# Altium project usomiq-bone-cape.PrjPcb
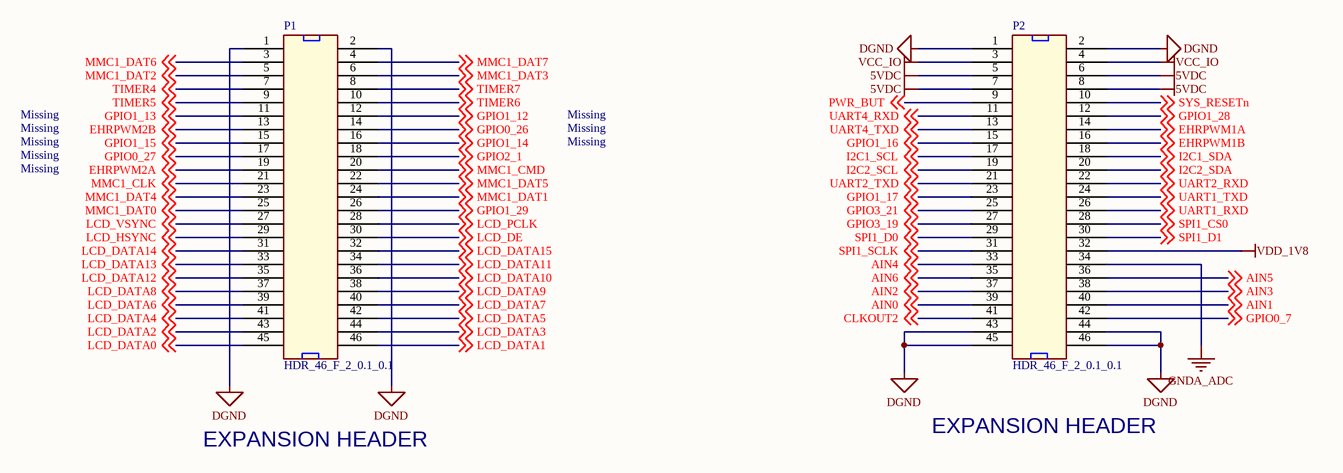
[diagram p0: bone_capes.SchDoc]
2 sheets, 61 parts. Net scope: global (net labels, ports and power ports of the same name join across sheets).
Board file: usomiq-bone-cape.PcbDoc
Sheets:
  bone_capes.SchDoc
  peripherals.SchDoc

## Sheet bone_capes.SchDoc
size A4

### Parts
P1  HDR_46_F_2_0.1_0.1  [DIP46]
P2  HDR_46_F_2_0.1_0.1  [DIP46]

### Nets
5VDC: P2.5 P2.6 P2.7 P2.8
DGND: P1.1 P1.2 P2.1 P2.2 P2.43 P2.44 P2.45 P2.46
GNDA_ADC: P2.34
VCC_IO: P2.3 P2.4
VDD_1V8: P2.32
AIN0: P2.39 ; off-sheet AIN0
AIN1: P2.40 ; off-sheet AIN1
AIN2: P2.37 ; off-sheet AIN2
AIN3: P2.38 ; off-sheet AIN3
AIN4: P2.33 ; off-sheet AIN4
AIN5: P2.36 ; off-sheet AIN5
AIN6: P2.35 ; off-sheet AIN6
CLKOUT2: P2.41 ; off-sheet CLKOUT2
EHRPWM1A: P2.14 ; off-sheet EHRPWM1A
EHRPWM1B: P2.16 ; off-sheet EHRPWM1B
EHRPWM2A: P1.19 ; off-sheet EHRPWM2A
EHRPWM2B: P1.13 ; off-sheet EHRPWM2B
GPIO0_7: P2.42 ; off-sheet GPIO0_7
GPIO0_26: P1.14 ; off-sheet GPIO0_26
GPIO0_27: P1.17 ; off-sheet GPIO0_27
GPIO1_12: P1.12 ; off-sheet GPIO1_12
GPIO1_13: P1.11 ; off-sheet GPIO1_13
GPIO1_14: P1.16 ; off-sheet GPIO1_14
GPIO1_15: P1.15 ; off-sheet GPIO1_15
GPIO1_16: P2.15 ; off-sheet GPIO1_16
GPIO1_17: P2.23 ; off-sheet GPIO1_17
GPIO1_28: P2.12 ; off-sheet GPIO1_28
GPIO1_29: P1.26 ; off-sheet GPIO1_29
GPIO2_1: P1.18 ; off-sheet GPIO2_1
GPIO3_19: P2.27 ; off-sheet GPIO3_19
GPIO3_21: P2.25 ; off-sheet GPIO3_21
I2C1_SCL: P2.17 ; off-sheet I2C1_SCL
I2C1_SDA: P2.18 ; off-sheet I2C1_SDA
I2C2_SCL: P2.19 ; off-sheet I2C2_SCL
I2C2_SDA: P2.20 ; off-sheet I2C2_SDA
LCD_DATA0: P1.45 ; off-sheet LCD_DATA0
LCD_DATA1: P1.46 ; off-sheet LCD_DATA1
LCD_DATA2: P1.43 ; off-sheet LCD_DATA2
LCD_DATA3: P1.44 ; off-sheet LCD_DATA3
LCD_DATA4: P1.41 ; off-sheet LCD_DATA4
LCD_DATA5: P1.42 ; off-sheet LCD_DATA5
LCD_DATA6: P1.39 ; off-sheet LCD_DATA6
LCD_DATA7: P1.40 ; off-sheet LCD_DATA7
LCD_DATA8: P1.37 ; off-sheet LCD_DATA8
LCD_DATA9: P1.38 ; off-sheet LCD_DATA9
LCD_DATA10: P1.36 ; off-sheet LCD_DATA10
LCD_DATA11: P1.34 ; off-sheet LCD_DATA11
LCD_DATA12: P1.35 ; off-sheet LCD_DATA12
LCD_DATA13: P1.33 ; off-sheet LCD_DATA13
LCD_DATA14: P1.31 ; off-sheet LCD_DATA14
LCD_DATA15: P1.32 ; off-sheet LCD_DATA15
LCD_DE: P1.30 ; off-sheet LCD_DE
LCD_HSYNC: P1.29 ; off-sheet LCD_HSYNC
LCD_PCLK: P1.28 ; off-sheet LCD_PCLK
LCD_VSYNC: P1.27 ; off-sheet LCD_VSYNC
MMC1_CLK: P1.21 ; off-sheet MMC1_CLK
MMC1_CMD: P1.20 ; off-sheet MMC1_CMD
MMC1_DAT0: P1.25 ; off-sheet MMC1_DAT0
MMC1_DAT1: P1.24 ; off-sheet MMC1_DAT1
MMC1_DAT2: P1.5 ; off-sheet MMC1_DAT2
MMC1_DAT3: P1.6 ; off-sheet MMC1_DAT3
MMC1_DAT4: P1.23 ; off-sheet MMC1_DAT4
MMC1_DAT5: P1.22 ; off-sheet MMC1_DAT5
MMC1_DAT6: P1.3 ; off-sheet MMC1_DAT6
MMC1_DAT7: P1.4 ; off-sheet MMC1_DAT7
PWR_BUT: P2.9 ; off-sheet PWR_BUT
SPI1_CS0: P2.28 ; off-sheet SPI1_CS0
SPI1_D0: P2.29 ; off-sheet SPI1_D0
SPI1_D1: P2.30 ; off-sheet SPI1_D1
SPI1_SCLK: P2.31 ; off-sheet SPI1_SCLK
SYS_RESETn: P2.10 ; off-sheet SYS_RESETn
TIMER4: P1.7 ; off-sheet TIMER4
TIMER5: P1.9 ; off-sheet TIMER5
TIMER6: P1.10 ; off-sheet TIMER6
TIMER7: P1.8 ; off-sheet TIMER7
UART1_RXD: P2.26 ; off-sheet UART1_RXD
UART1_TXD: P2.24 ; off-sheet UART1_TXD
UART2_RXD: P2.22 ; off-sheet UART2_RXD
UART2_TXD: P2.21 ; off-sheet UART2_TXD
UART4_RXD: P2.11 ; off-sheet UART4_RXD
UART4_TXD: P2.13 ; off-sheet UART4_TXD

### Notes on the sheet
- Missing
- EXPANSION HEADER

### Library data of the parts
P1 P2 = HDR_46_F_2_0.1_0.1: NN HEADER FMAL 46PS.1" DL GOLD; Mfr: major league electronics; P/N: SSHS-123-D-02-GT-LF

## Sheet peripherals.SchDoc
size A3
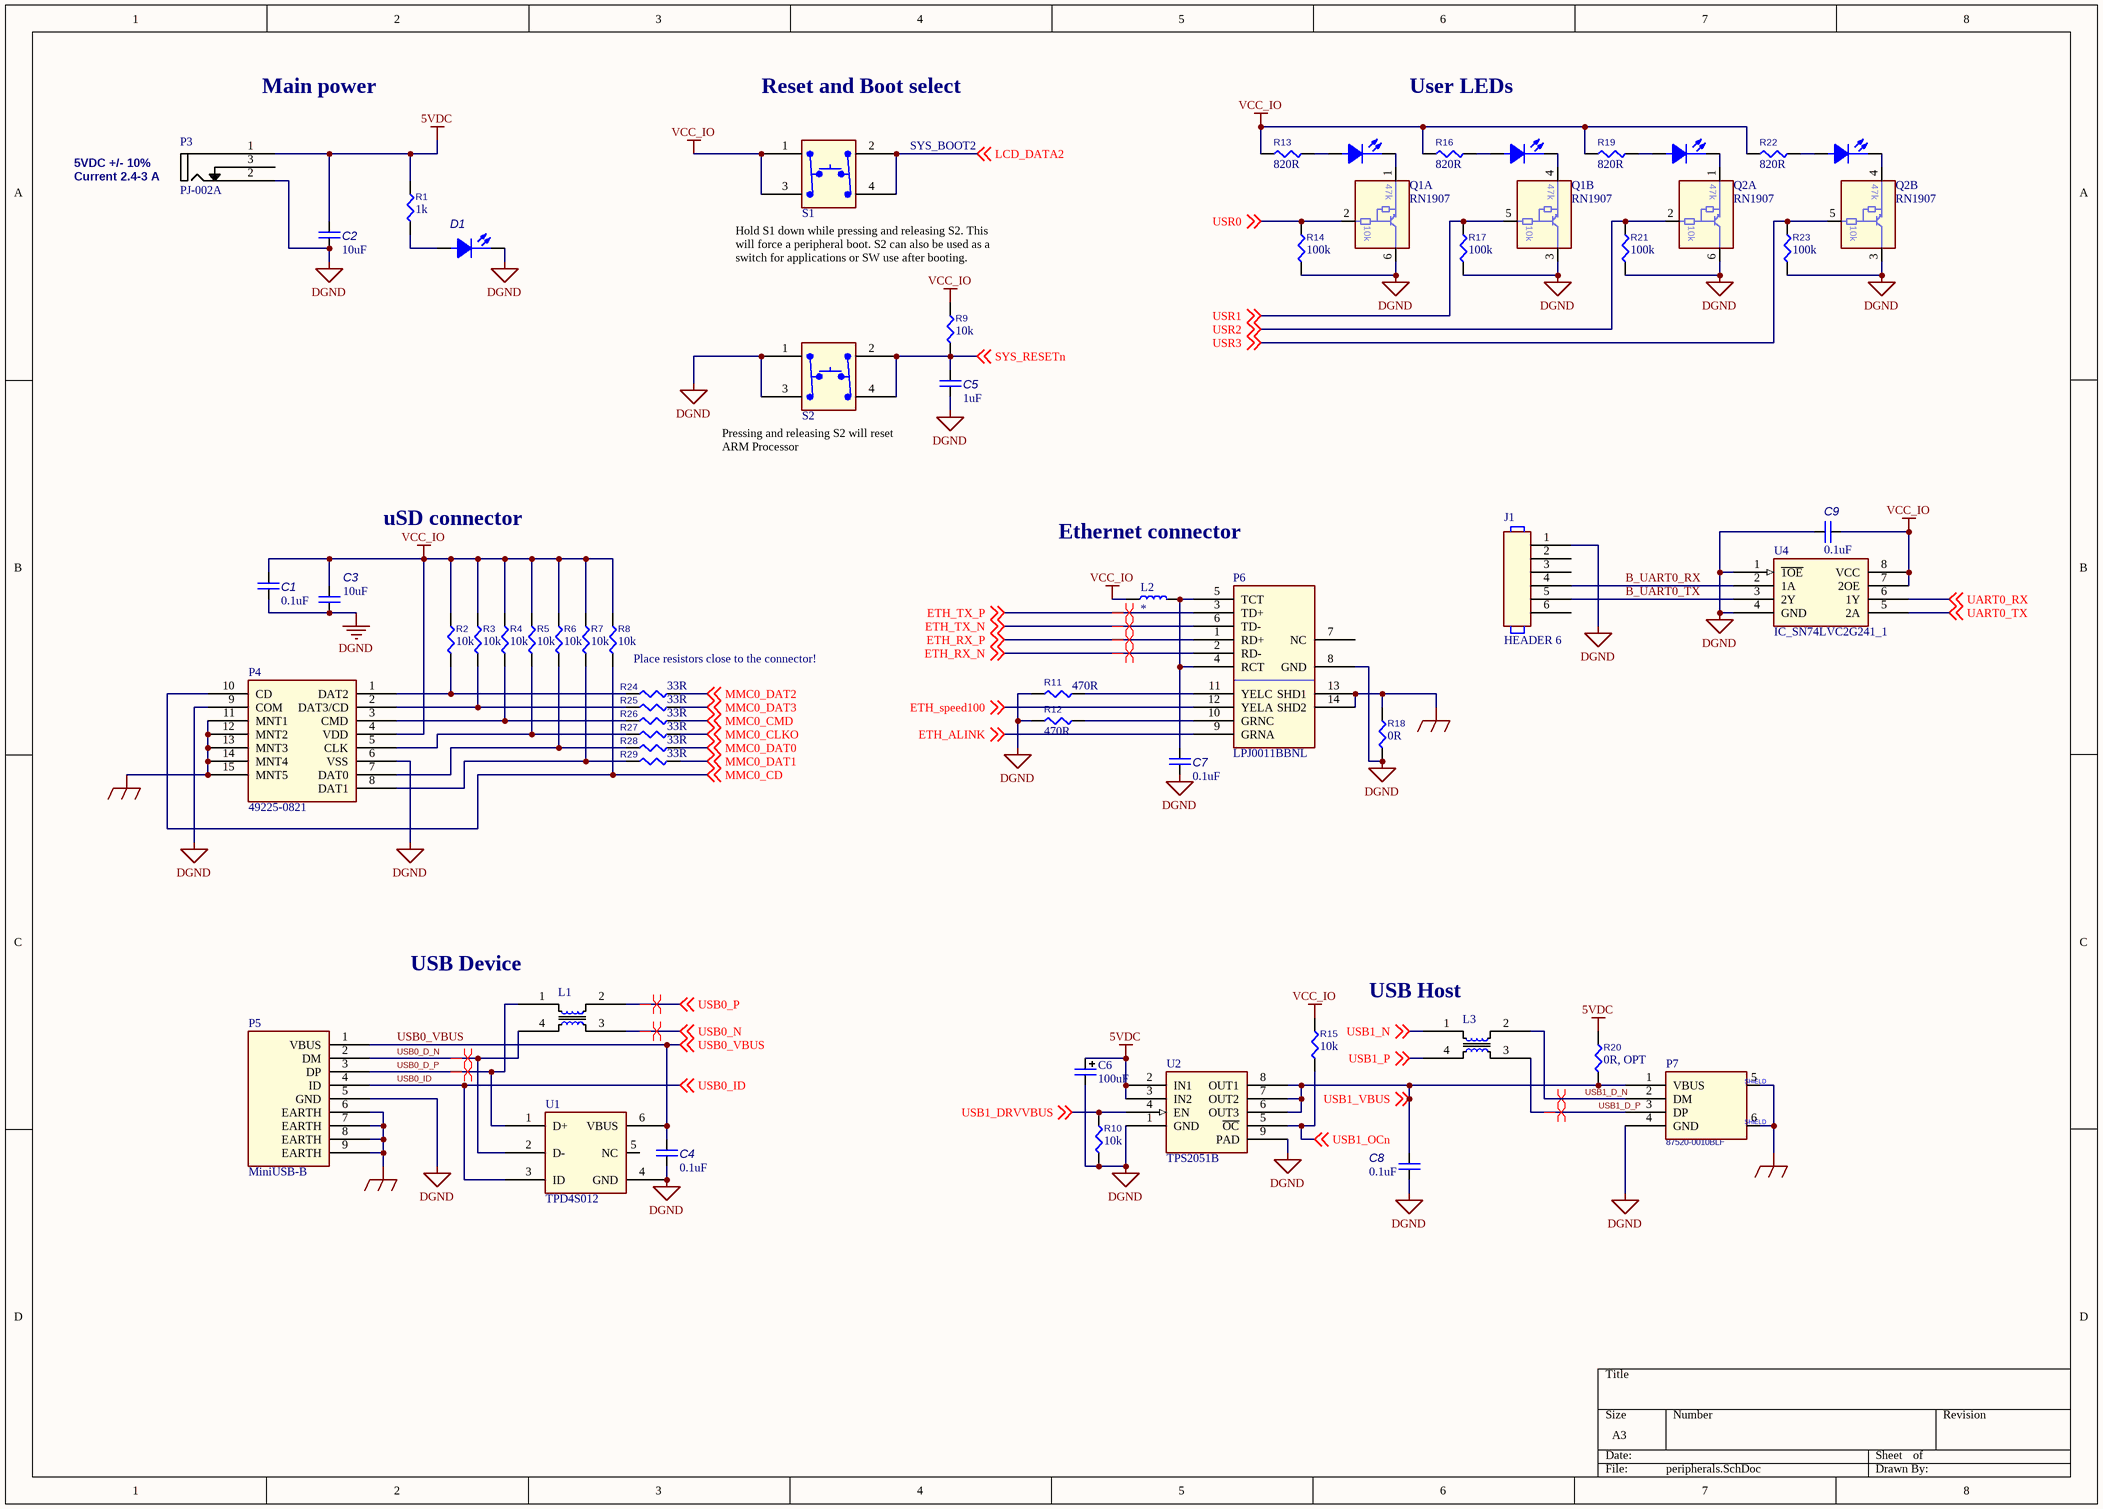
[diagram p1: peripherals.SchDoc]

### Parts
C1  value 0.1uF  [CC1608-0603]  (hidden comment: C0603)
C2  value 10uF  [CC2012-0805]  (hidden comment: C0805)
C3  value 10uF  [CC2012-0805]  (hidden comment: C0805)
C4  value 0.1uF  [CC1608-0603]  (hidden comment: C0603)
C5  value 1uF  [CC1608-0603]  (hidden comment: C0603)
C6  value 100uF  [Cap_C]  (hidden comment: Cap_C)
C7  value 0.1uF  [CC1608-0603]  (hidden comment: C0603)
C8  value 0.1uF  [CC1608-0603]  (hidden comment: C0603)
C9  value 0.1uF  [CC1608-0603]  (hidden comment: C0603)
D1  LED0805  [LED0805]  (value not drawn)
D2  LED0805  [LED0805]  (value not drawn)
D3  LED0805  [LED0805]  (value not drawn)
D4  LED0805  [LED0805]  (value not drawn)
D5  LED0805  [LED0805]  (value not drawn)
J1  HEADER 6  [DIP6]
L1  DLW21H  [DLW21H]  (value not drawn)
L2  BLM18A-FB  [CHIP0603]  (value not drawn)
L3  DLW21H  [DLW21H]  (value not drawn)
P3  PJ-002A  [PJ-002A]
P4  49225-0821  [SDCard]
P5  MiniUSB-B  [MINI-USB-B5 SMT]
P6  P/N: LPJ0011BBNL  [TRJ0011ABNL]  (hidden comment: CONN_RJ45_MAG_WE_0)
P7  P/N: 87520-0010BLF  [USB2.5-2H4C]  (hidden comment: CONN_54819-0578_2)
Q1  RN1907  [SOT363-6L]  (parts A,B of 2)
Q2  RN1907  [SOT363-6L]  (parts A,B of 2)
R1  value 1k  [RESC1608X55N]  (hidden comment: R0603)
R2  value 10k  [RESC1608X55N]  (hidden comment: R0603)
R3  value 10k  [RESC1608X55N]  (hidden comment: R0603)
R4  value 10k  [RESC1608X55N]  (hidden comment: R0603)
R5  value 10k  [RESC1608X55N]  (hidden comment: R0603)
R6  value 10k  [RESC1608X55N]  (hidden comment: R0603)
R7  value 10k  [RESC1608X55N]  (hidden comment: R0603)
R8  value 10k  [RESC1608X55N]  (hidden comment: R0603)
R9  value 10k  [RESC1608X55N]  (hidden comment: R0603)
R10  value 10k  [RESC1608X55N]  (hidden comment: R0603)
R11  value 470R  [RESC1608X55N]  (hidden comment: R0603)
R12  value 470R  [RESC1608X55N]  (hidden comment: R0603)
R13  value 820R  [RESC1608X55N]  (hidden comment: R0603)
R14  value 100k  [RESC1608X55N]  (hidden comment: R0603)
R15  value 10k  [RESC1608X55N]  (hidden comment: R0603)
R16  value 820R  [RESC1608X55N]  (hidden comment: R0603)
R17  value 100k  [RESC1608X55N]  (hidden comment: R0603)
R18  value 0R  [RESC1608X55N]  (hidden comment: R0603)
R19  value 820R  [RESC1608X55N]  (hidden comment: R0603)
R20  value 0R, OPT  [RESC1608X55N]  (hidden comment: R0603)
R21  value 100k  [RESC1608X55N]  (hidden comment: R0603)
R22  value 820R  [RESC1608X55N]  (hidden comment: R0603)
R23  value 100k  [RESC1608X55N]  (hidden comment: R0603)
R24  value 33R  [RESC1608X55N]  (hidden comment: R0603)
R25  value 33R  [RESC1608X55N]  (hidden comment: R0603)
R26  value 33R  [RESC1608X55N]  (hidden comment: R0603)
R27  value 33R  [RESC1608X55N]  (hidden comment: R0603)
R28  value 33R  [RESC1608X55N]  (hidden comment: R0603)
R29  value 33R  [RESC1608X55N]  (hidden comment: R0603)
S1  SW_KT11P2JM_2  [KMR231GLFS]  (value not drawn)
S2  SW_KT11P2JM_2  [KMR231GLFS]  (value not drawn)
U1  TPD4S012  [s-puson-n6]
U2  TPS2051B  [R-PDSO-G8]
U4  IC_SN74LVC2G241_1  [SOP127P600-8N]

### Nets
5VDC: C2.2 C6.1 P3.1(GND) R1.2 R20.2 U2.2(IN1) U2.3(IN2)
DGND: C1.2 C2.1 C3.1 C4.2 C5.2 C6.2 C7.2 C8.1 C9.1 D1.2(C) J1.1 P3.2(RIGHT) P4.6(VSS) P4.9(COM) P5.5(GND) P6.8(GND) P7.4(GND) Q1.3 Q1.6 Q2.3 Q2.6 R10.1 R11.1 R12.1 R14.1 R17.1 R18.1 R21.1 R23.1 S2.1(A1) S2.3(A2) U1.4(GND) U2.1(GND) U2.9(PAD) U4.1(~{1OE}) U4.4(GND)
EARTH: P4.11(MNT1) P4.12(MNT2) P4.13(MNT3) P4.14(MNT4) P4.15(MNT5) P5.6(EARTH) P5.7(EARTH) P5.8(EARTH) P5.9(EARTH) P6.13(SHD1) P6.14(SHD2) P7.5(SHELD1) P7.6(PAD4) R18.2
VCC_IO: C1.1 C3.2 C9.2 L2.1 P4.4(VDD) R2.2 R3.2 R4.2 R5.2 R6.2 R7.2 R8.2 R9.2 R13.2 R15.2 R16.2 R19.2 R22.2 S1.1(A1) S1.3(A2) U4.7(2OE) U4.8(VCC)
B_UART0_RX: J1.4 U4.2(1A)
B_UART0_TX: J1.5 U4.3(2Y)
ETH_ALINK: P6.9(GRNA) ; off-sheet ETH_ALINK
ETH_RX_N: P6.2(RD-) ; off-sheet ETH_RX_N
ETH_RX_P: P6.1(RD+) ; off-sheet ETH_RX_P
ETH_speed100: P6.12(YELA) ; off-sheet ETH_speed100
ETH_TX_N: P6.6(TD-) ; off-sheet ETH_TX_N
ETH_TX_P: P6.3(TD+) ; off-sheet ETH_TX_P
LCD_DATA2: S1.2(B1) S1.4(B2) ; off-sheet LCD_DATA2
MMC0_CD: P4.10(CD) R8.1 ; off-sheet MMC0_CD
MMC0_CLKO: R27.2 ; off-sheet MMC0_CLKO
MMC0_CMD: R26.2 ; off-sheet MMC0_CMD
MMC0_DAT0: R28.2 ; off-sheet MMC0_DAT0
MMC0_DAT1: R29.2 ; off-sheet MMC0_DAT1
MMC0_DAT2: R24.2 ; off-sheet MMC0_DAT2
MMC0_DAT3: R25.2 ; off-sheet MMC0_DAT3
SYS_RESETn: C5.1 R9.1 S2.2(B1) S2.4(B2) ; off-sheet SYS_RESETn
UART0_RX: U4.6(1Y) ; off-sheet UART0_RX
UART0_TX: U4.5(2A) ; off-sheet UART0_TX
USB0_D_N: L1.4 P5.2(DM) U1.2(D-)
USB0_D_P: L1.1 P5.3(DP) U1.1(D+)
USB0_ID: P5.4(ID) U1.3(ID) ; off-sheet USB0_ID
USB0_N: L1.3 ; off-sheet USB0_N
USB0_P: L1.2 ; off-sheet USB0_P
USB0_VBUS: C4.1 P5.1(VBUS) U1.6(VBUS) ; off-sheet USB0_VBUS
USB1_D_N: L3.2 P7.2(DM)
USB1_D_P: L3.3 P7.3(DP)
USB1_DRVVBUS: R10.2 U2.4(EN) ; off-sheet USB1_DRVVBUS
USB1_N: L3.1 ; off-sheet USB1_N
USB1_OCn: R15.1 U2.5(~{OC}) ; off-sheet USB1_OCn
USB1_P: L3.4 ; off-sheet USB1_P
USB1_VBUS: C8.2 P7.1(VBUS) R20.1 U2.6(OUT3) U2.7(OUT2) U2.8(OUT1) ; off-sheet USB1_VBUS
USR0: Q1.2 R14.2 ; off-sheet USR0
USR1: Q1.5 R17.2 ; off-sheet USR1
USR2: Q2.2 R21.2 ; off-sheet USR2
USR3: Q2.5 R23.2 ; off-sheet USR3
NetC7_1: C7.1 L2.2 P6.4(RCT) P6.5(TCT)
NetD1_1: D1.1(A) R1.1
NetD2_1: D2.1(A) R13.1
NetD2_2: D2.2(C) Q1.1
NetD3_1: D3.1(A) R16.1
NetD3_2: D3.2(C) Q1.4
NetD4_1: D4.1(A) R19.1
NetD4_2: D4.2(C) Q2.1
NetD5_1: D5.1(A) R22.1
NetD5_2: D5.2(C) Q2.4
NetP4_1: P4.1(DAT2) R2.1 R24.1
NetP4_2: P4.2(DAT3/CD) R3.1 R25.1
NetP4_3: P4.3(CMD) R4.1 R26.1
NetP4_5: P4.5(CLK) R5.1 R27.1
NetP4_7: P4.7(DAT0) R6.1 R28.1
NetP4_8: P4.8(DAT1) R7.1 R29.1
NetP6_10: P6.10(GRNC) R12.2
NetP6_11: P6.11(YELC) R11.2

Not connected (* = marked no-connect by the designer): J1 2 3 6; P3 3(LEFT); P6 7(NC); U1 5(NC)

### Layout directives
differential pair: ETH_RX_N, ETH_RX_P, ETH_TX_N, ETH_TX_P, USB0_D_N, USB0_D_P, USB0_N, USB0_P, USB1_D_N, USB1_D_P

### Notes on the sheet
- Main power
- Reset and Boot select
- User LEDs
- SYS_BOOT2
- 5VDC +/- 10%
  Current 2.4-3 A
- Hold S1 down while pressing and releasing S2. This
  will force a peripheral boot. S2 can also be used as a
  switch for applications or SW use after booting.
- (near S2) Pressing and releasing S2 will reset ARM Processor
- uSD connector
- Ethernet connector
- Place resistors close to the connector!
- (near L1) USB Device
- (near L3) USB Host
- (in symbol CONN_54819-0578_2) SHIELD

### Library data of the parts
C6 = Cap_C: Tantalum Capacitor Case C; P/N: *
D1-D5 = LED0805: LED 0805; Value: *
J1 = HEADER 6: CONN HEADER 6POS, VERTICAL,  .100 STR TIN; Mfr: FCI; P/N: 68000-406HLF
L1 L3 = DLW21H: Low profile wire-wound common choke coil; Manufacturer: Murata; Man P/N: DLW21HN900SQ2
L2 = BLM18A-FB: Chip EMIFILr Inductor Type; Manufacturer: Murata; Man P/N: *
P3 = PJ-002A: DC POWER JACK; Manufacturer: CIU Inc; Vendor: Digi-key; Alternative P/N: DJK-02A; Man P/N: PJ-002A
P4 = Mol_49225-0821: Connector for microSD™ Card (Push-push Type); Manufacturer: Molex; Man P/N: 49225-0821
P5 = MiniUSB-B: Mini USB Type B CONNECTOR; Mfr: Hirose; P/N: UX60SC-MB-5ST(80)
P6 = CONN_RJ45_MAG_WE_0: RJ-45 10/100 W/Magnetics; Mfr: Link PP; P/N-2: Wurth 7499011212
P7 = CONN_54819-0578_2: USB Type A Connectors; Mfr: FCI
Q1 Q2 = RN1907: Transistor Silicon NPN; Mfr: Panasonic; P/N: DMC564040R
S1 S2 = SW_KT11P2JM_2: SMD button; Mfr: C&K Components; P/N: KMR231GLFS
U1 = TPD4S012: 4-Channel USB ESD Solution with Power Clamp; Mfr: TI; P/N: TPD4S012DRYR
U2 = TPS2051B: CURRENT-LIMITED, POWER-DISTRIBUTION SWITCHES; Mfr: TI; P/N: TPS2051BDGN
U4 = IC_SN74LVC2G241_1: Dual Buffer/Driver With 3-State Outputs; Mfr: TI; P/N: SN74LVC2G241DCU
C1 C4 C5 C7-C9 = C0603: P/N: *
C2 C3 = C0805: P/N: *
R1-R29 = R0603: P/N: *

## Nets that join several sheets
5VDC: bone_capes (P2.5 P2.6 P2.7 P2.8), peripherals (7 pins)
DGND: bone_capes (8 pins), peripherals (36 pins)
VCC_IO: bone_capes (P2.3 P2.4), peripherals (22 pins)
LCD_DATA2: bone_capes (P1.43), peripherals (S1.2 S1.4)
SYS_RESETn: bone_capes (P2.10), peripherals (C5.1 R9.1 S2.2 S2.4)